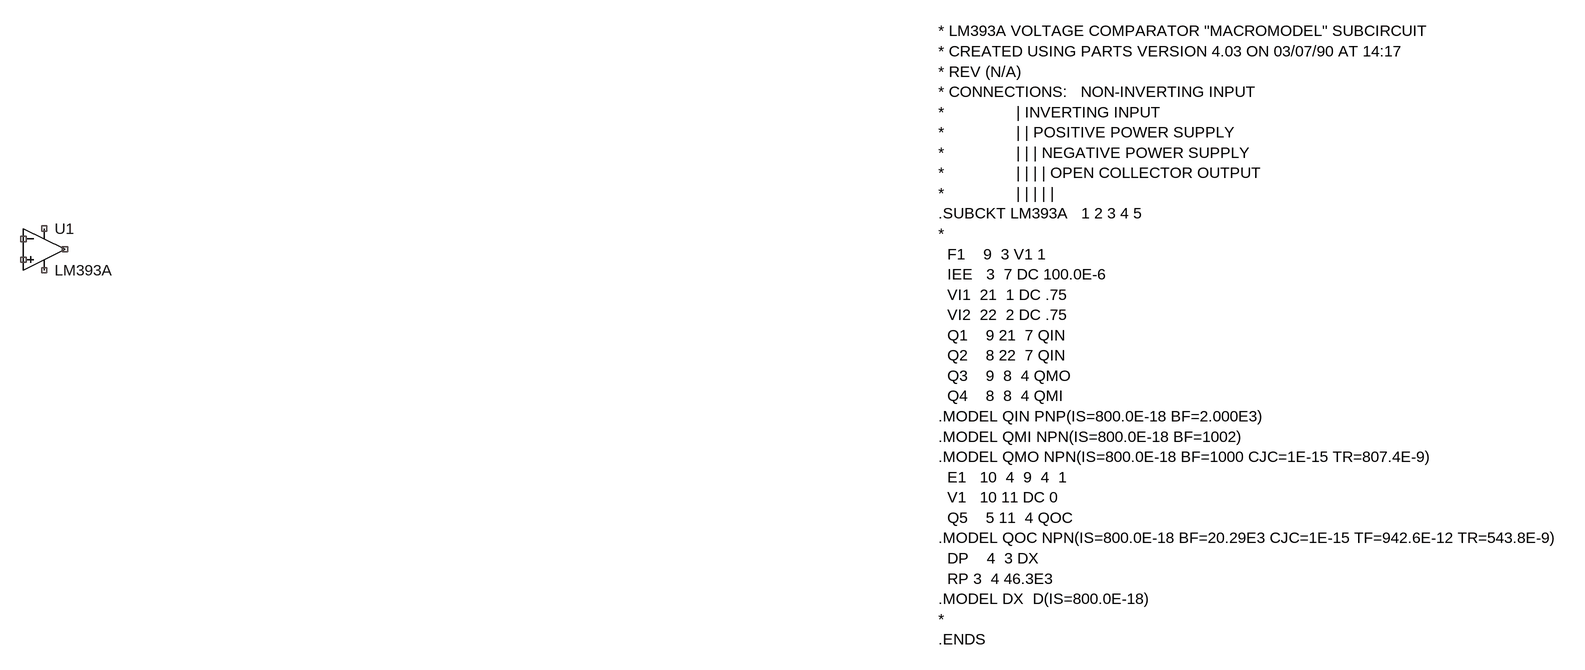
[diagram p0: schematic PWM.asc]
PWM.asc, the LTspice schematic file:
Version 4
SHEET 1 1792 680
SYMBOL OpAmps\\opamp2 -592 0 R0
SYMATTR InstName U1
SYMATTR Value LM393A
TEXT 784 -272 Left 2 !* LM393A VOLTAGE COMPARATOR "MACROMODEL" SUBCIRCUIT\n* CREATED USING PARTS VERSION 4.03 ON 03/07/90 AT 14:17\n* REV (N/A)\n* CONNECTIONS:   NON-INVERTING INPUT\n*                | INVERTING INPUT\n*                | | POSITIVE POWER SUPPLY\n*                | | | NEGATIVE POWER SUPPLY\n*                | | | | OPEN COLLECTOR OUTPUT\n*                | | | | |\n.SUBCKT LM393A   1 2 3 4 5\n*\n  F1    9  3 V1 1\n  IEE   3  7 DC 100.0E-6\n  VI1  21  1 DC .75\n  VI2  22  2 DC .75\n  Q1    9 21  7 QIN\n  Q2    8 22  7 QIN\n  Q3    9  8  4 QMO\n  Q4    8  8  4 QMI\n.MODEL QIN PNP(IS=800.0E-18 BF=2.000E3)\n.MODEL QMI NPN(IS=800.0E-18 BF=1002)\n.MODEL QMO NPN(IS=800.0E-18 BF=1000 CJC=1E-15 TR=807.4E-9)\n  E1   10  4  9  4  1\n  V1   10 11 DC 0\n  Q5    5 11  4 QOC\n.MODEL QOC NPN(IS=800.0E-18 BF=20.29E3 CJC=1E-15 TF=942.6E-12 TR=543.8E-9)\n  DP    4  3 DX\n  RP 3  4 46.3E3\n.MODEL DX  D(IS=800.0E-18)\n*\n.ENDS

The netlist it stands for:
* PWM.asc
XU1 NC_01 NC_02 NC_03 NC_04 NC_05 LM393A  ; pins In+ In- V+ V- OUT
* LM393A VOLTAGE COMPARATOR "MACROMODEL" SUBCIRCUIT
* CREATED USING PARTS VERSION 4.03 ON 03/07/90 AT 14:17
* REV (N/A)
* CONNECTIONS:   NON-INVERTING INPUT
*                | INVERTING INPUT
*                | | POSITIVE POWER SUPPLY
*                | | | NEGATIVE POWER SUPPLY
*                | | | | OPEN COLLECTOR OUTPUT
*                | | | | |
.SUBCKT LM393A   1 2 3 4 5
*
  F1    9  3 V1 1
  IEE   3  7 DC 100.0E-6
  VI1  21  1 DC .75
  VI2  22  2 DC .75
  Q1    9 21  7 QIN
  Q2    8 22  7 QIN
  Q3    9  8  4 QMO
  Q4    8  8  4 QMI
.MODEL QIN PNP(IS=800.0E-18 BF=2.000E3)
.MODEL QMI NPN(IS=800.0E-18 BF=1002)
.MODEL QMO NPN(IS=800.0E-18 BF=1000 CJC=1E-15 TR=807.4E-9)
  E1   10  4  9  4  1
  V1   10 11 DC 0
  Q5    5 11  4 QOC
.MODEL QOC NPN(IS=800.0E-18 BF=20.29E3 CJC=1E-15 TF=942.6E-12 TR=543.8E-9)
  DP    4  3 DX
  RP 3  4 46.3E3
.MODEL DX  D(IS=800.0E-18)
*
.ENDS
.backanno
.end